# Altium schematic sheet TopLevel.SchDoc
size 381 x 279 mm; Organization: SACO Technologies; Address1: 7806, Trans-Canada Hwy; Address2: Montreal, QC, Canada - H4S1L3.; Address3: H4S1L3; SheetNumber: 2; SheetTotal: 6; ELE682ProjectName: Conditioning & TLL PCB; ProjectRevision: C; SchDesignedBy1: Alexis Gagnon; SchDesignedBy2: Megane Cyr
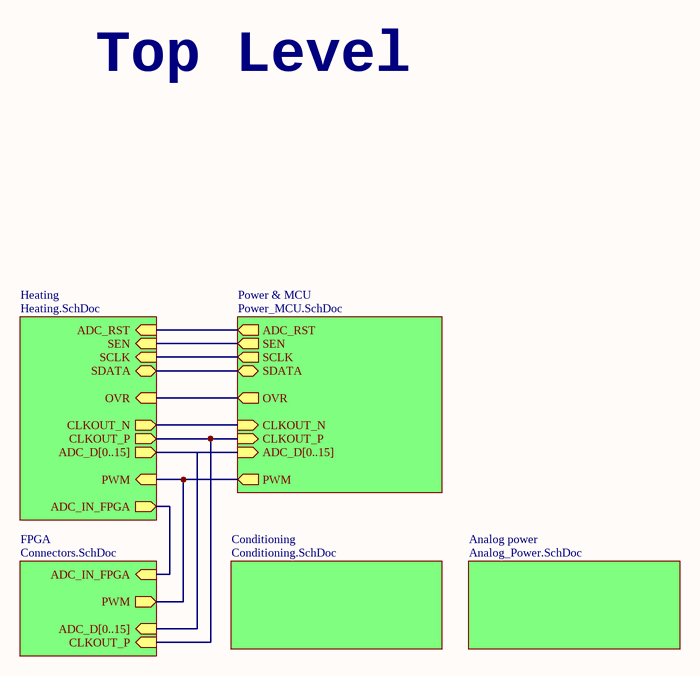
[diagram p0: TopLevel.SchDoc]

## Sub-sheets
Analog power = Analog_Power.SchDoc: no entries
Conditioning = Conditioning.SchDoc: no entries
FPGA = Connectors.SchDoc: ADC_D[0..15] (in), ADC_IN_FPGA (in), PWM (out), CLKOUT_P (in)
Heating = Heating.SchDoc: ADC_D[0..15] (out), OVR (in), ADC_RST (in), SCLK (in), SDATA (bidir), SEN (in), CLKOUT_N (out), CLKOUT_P (out), PWM (in), ADC_IN_FPGA (out)
Power & MCU = Power_MCU.SchDoc: ADC_D[0..15] (in), OVR (out), ADC_RST (out), SCLK (out), SDATA (bidir), SEN (out), CLKOUT_N (in), CLKOUT_P (in), PWM (out)

## Nets
(unnamed): sheet Heating/OVR, sheet Power & MCU/OVR
(unnamed): sheet Heating/ADC_RST, sheet Power & MCU/ADC_RST
(unnamed): sheet Heating/SCLK, sheet Power & MCU/SCLK
(unnamed): sheet Heating/SDATA, sheet Power & MCU/SDATA
(unnamed): sheet Heating/SEN, sheet Power & MCU/SEN
(unnamed): sheet Heating/CLKOUT_N, sheet Power & MCU/CLKOUT_N
(unnamed): sheet Heating/CLKOUT_P, sheet Power & MCU/CLKOUT_P, sheet FPGA/CLKOUT_P
(unnamed): sheet Heating/PWM, sheet Power & MCU/PWM, sheet FPGA/PWM
(unnamed): sheet Heating/ADC_IN_FPGA, sheet FPGA/ADC_IN_FPGA

## Buses and harness runs
bus sheet FPGA/ADC_D[0..15] = sheet Heating/ADC_D[0..15] = sheet Power & MCU/ADC_D[0..15]

## Notes on the sheet
- Top Level
- Project:
- File:
- Date:
- Designed By :
- © COPYRIGHT 2024 École de Technologie Supérieure
- Revision:
- Sheet
- of
- 1100 Rue Notre-Dame Ouest, Montréal, QC H3C 1K3